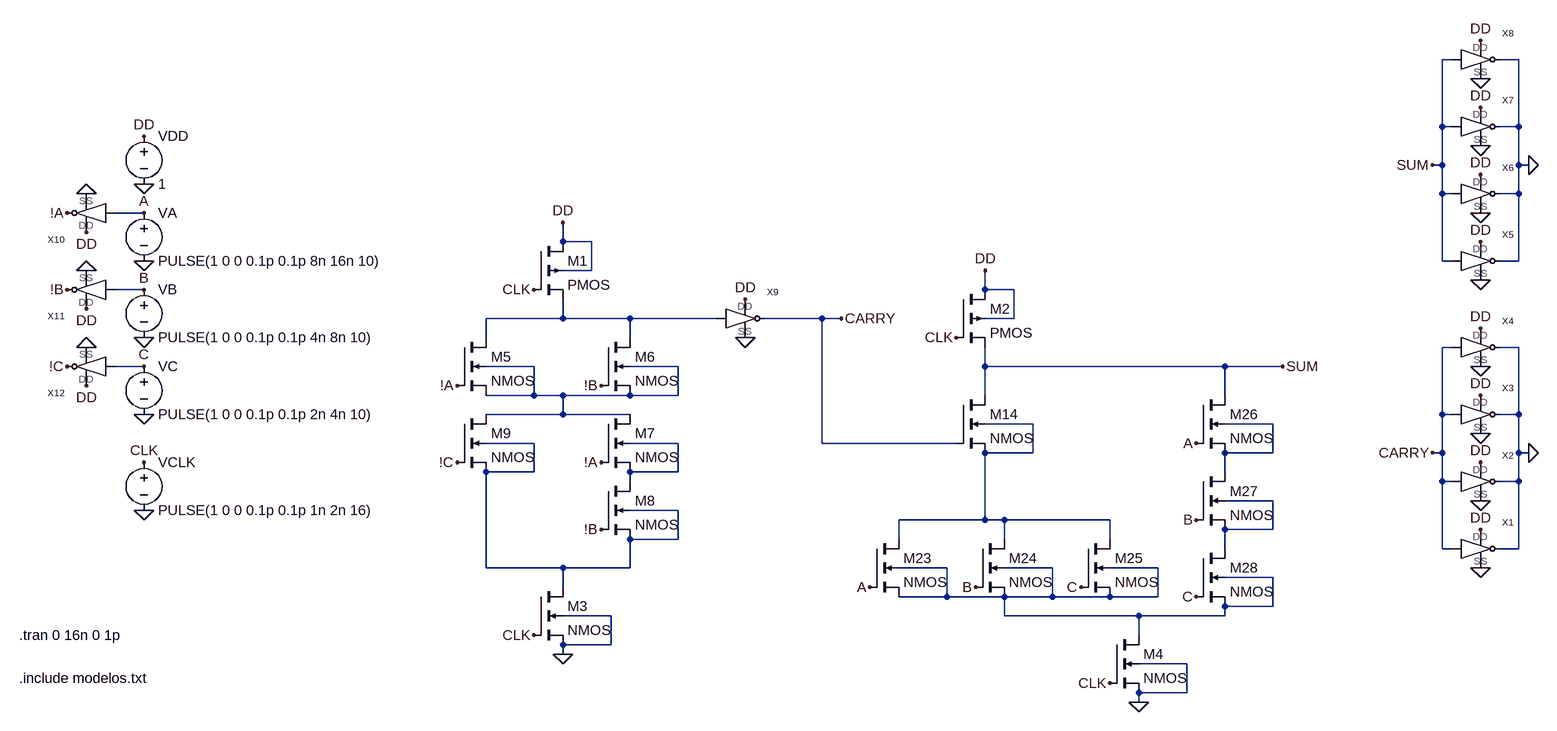
[diagram p0: schematic 2_2.asc]
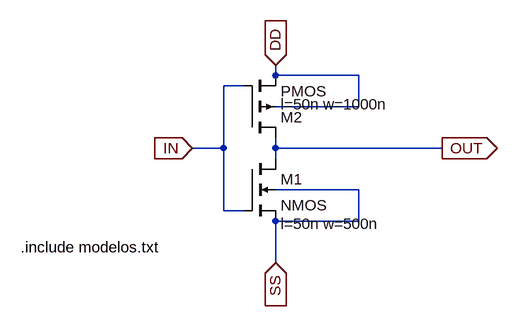
[diagram p1: sub-circuit simb_inv.asc]
2_2.asc, the LTspice schematic file:
Version 4
SHEET 1 3300 1020
WIRE 3152 -80 3136 -80
WIRE 3264 -80 3232 -80
WIRE 3136 32 3136 -80
WIRE 3152 32 3136 32
WIRE 3264 32 3264 -80
WIRE 3264 32 3232 32
WIRE 3136 96 3136 32
WIRE 3136 96 3120 96
WIRE 3264 96 3264 32
WIRE 3280 96 3264 96
WIRE 3136 144 3136 96
WIRE 3152 144 3136 144
WIRE 3264 144 3264 96
WIRE 3264 144 3232 144
WIRE -80 176 -128 176
WIRE 800 224 800 192
WIRE 848 224 800 224
WIRE 3136 256 3136 144
WIRE 3152 256 3136 256
WIRE 3264 256 3264 144
WIRE 3264 256 3232 256
WIRE 848 272 848 224
WIRE 848 272 800 272
WIRE -80 304 -128 304
WIRE 1504 304 1504 272
WIRE 1552 304 1504 304
WIRE 800 352 800 320
WIRE 800 352 672 352
WIRE 912 352 800 352
WIRE 1056 352 912 352
WIRE 1232 352 1136 352
WIRE 1264 352 1232 352
WIRE 1552 352 1552 304
WIRE 1552 352 1504 352
WIRE 672 384 672 352
WIRE 912 384 912 352
WIRE 3152 400 3136 400
WIRE 3264 400 3232 400
WIRE -80 432 -128 432
WIRE 752 432 672 432
WIRE 992 432 912 432
WIRE 1504 432 1504 400
WIRE 1904 432 1504 432
WIRE 2000 432 1904 432
WIRE 752 480 752 432
WIRE 752 480 672 480
WIRE 800 480 752 480
WIRE 912 480 800 480
WIRE 992 480 992 432
WIRE 992 480 912 480
WIRE 1504 480 1504 432
WIRE 1904 480 1904 432
WIRE 800 512 800 480
WIRE 800 512 672 512
WIRE 912 512 800 512
WIRE 3136 512 3136 400
WIRE 3152 512 3136 512
WIRE 3264 512 3264 400
WIRE 3264 512 3232 512
WIRE 1584 528 1504 528
WIRE 1984 528 1904 528
WIRE 752 560 672 560
WIRE 992 560 912 560
WIRE 1232 560 1232 352
WIRE 1456 560 1232 560
WIRE 1584 576 1584 528
WIRE 1584 576 1504 576
WIRE 1984 576 1984 528
WIRE 1984 576 1904 576
WIRE 3136 576 3136 512
WIRE 3136 576 3120 576
WIRE 3264 576 3264 512
WIRE 3280 576 3264 576
WIRE 752 608 752 560
WIRE 752 608 672 608
WIRE 992 608 992 560
WIRE 992 608 912 608
WIRE 1904 608 1904 576
WIRE 912 624 912 608
WIRE 3136 624 3136 576
WIRE 3152 624 3136 624
WIRE 3264 624 3264 576
WIRE 3264 624 3232 624
WIRE 1984 656 1904 656
WIRE 992 672 912 672
WIRE 1504 688 1504 576
WIRE 1504 688 1360 688
WIRE 1536 688 1504 688
WIRE 1712 688 1536 688
WIRE 1984 704 1984 656
WIRE 1984 704 1904 704
WIRE 992 720 992 672
WIRE 992 720 912 720
WIRE 1360 720 1360 688
WIRE 1536 720 1536 688
WIRE 1712 720 1712 688
WIRE 1904 736 1904 704
WIRE 3136 736 3136 624
WIRE 3152 736 3136 736
WIRE 3264 736 3264 624
WIRE 3264 736 3232 736
WIRE 672 768 672 608
WIRE 800 768 672 768
WIRE 912 768 912 720
WIRE 912 768 800 768
WIRE 1440 768 1360 768
WIRE 1616 768 1536 768
WIRE 1792 768 1712 768
WIRE 1984 784 1904 784
WIRE 800 800 800 768
WIRE 1440 816 1440 768
WIRE 1440 816 1360 816
WIRE 1536 816 1440 816
WIRE 1616 816 1616 768
WIRE 1616 816 1536 816
WIRE 1712 816 1616 816
WIRE 1792 816 1792 768
WIRE 1792 816 1712 816
WIRE 1984 832 1984 784
WIRE 1984 832 1904 832
WIRE 880 848 800 848
WIRE 1536 848 1536 816
WIRE 1760 848 1536 848
WIRE 1904 848 1904 832
WIRE 1904 848 1760 848
WIRE 1760 880 1760 848
WIRE 880 896 880 848
WIRE 880 896 800 896
WIRE 800 912 800 896
WIRE 1840 928 1760 928
WIRE 1840 976 1840 928
WIRE 1840 976 1760 976
WIRE 1760 992 1760 976
FLAG -80 512 0
FLAG -80 384 0
FLAG -80 256 0
FLAG -80 128 0
FLAG -80 48 DD
FLAG -80 176 A
FLAG -80 304 B
FLAG -80 432 C
FLAG 1264 352 CARRY
FLAG 1504 272 DD
FLAG 2000 432 SUM
FLAG 1312 800 A
FLAG 1488 800 B
FLAG 1664 800 C
FLAG 1856 560 A
FLAG 1856 688 B
FLAG 1856 816 C
FLAG 3200 288 0
FLAG 3200 176 0
FLAG 3200 64 0
FLAG 3200 -48 0
FLAG 3200 -112 DD
FLAG 3200 0 DD
FLAG 3200 112 DD
FLAG 3200 224 DD
FLAG 3280 96 0
FLAG 3120 96 SUM
FLAG 3200 768 0
FLAG 3200 656 0
FLAG 3200 544 0
FLAG 3200 432 0
FLAG 3200 368 DD
FLAG 3200 480 DD
FLAG 3200 592 DD
FLAG 3200 704 DD
FLAG 3280 576 0
FLAG 3120 576 CARRY
FLAG 1456 384 CLK
FLAG -80 672 0
FLAG -80 592 CLK
FLAG 800 192 DD
FLAG 752 304 CLK
FLAG 752 880 CLK
FLAG 1712 960 CLK
FLAG 1760 992 0
FLAG 800 912 0
FLAG 624 464 !A
FLAG 864 592 !A
FLAG 864 704 !B
FLAG 864 464 !B
FLAG 624 592 !C
FLAG 1104 320 DD
FLAG 1104 384 0
FLAG -208 176 !A
FLAG -208 304 !B
FLAG -208 432 !C
FLAG -176 400 0
FLAG -176 272 0
FLAG -176 144 0
FLAG -176 208 DD
FLAG -176 336 DD
FLAG -176 464 DD
SYMBOL voltage -80 32 R0
SYMATTR InstName VDD
SYMATTR Value 1
SYMBOL voltage -80 160 R0
WINDOW 123 0 0 Left 2
WINDOW 39 0 0 Left 2
SYMATTR InstName VA
SYMATTR Value PULSE(1 0 0 0.1p 0.1p 8n 16n 10)
SYMBOL voltage -80 288 R0
WINDOW 123 0 0 Left 2
WINDOW 39 0 0 Left 2
SYMATTR InstName VB
SYMATTR Value PULSE(1 0 0 0.1p 0.1p 4n 8n 10)
SYMBOL voltage -80 416 R0
WINDOW 123 0 0 Left 2
WINDOW 39 0 0 Left 2
SYMATTR InstName VC
SYMATTR Value PULSE(1 0 0 0.1p 0.1p 2n 4n 10)
SYMBOL nmos4 1456 480 R0
SYMATTR InstName M14
SYMATTR Value2 l=50n w=1000n
SYMBOL nmos4 1312 720 R0
SYMATTR InstName M23
SYMATTR Value2 l=50n w=1000n
SYMBOL nmos4 1488 720 R0
SYMATTR InstName M24
SYMATTR Value2 l=50n w=1000n
SYMBOL nmos4 1664 720 R0
SYMATTR InstName M25
SYMATTR Value2 l=50n w=1000n
SYMBOL nmos4 1856 480 R0
SYMATTR InstName M26
SYMATTR Value2 l=50n w=1500n
SYMBOL nmos4 1856 608 R0
SYMATTR InstName M27
SYMATTR Value2 l=50n w=1500n
SYMBOL nmos4 1856 736 R0
SYMATTR InstName M28
SYMATTR Value2 l=50n w=1500n
SYMBOL pmos4 752 224 R0
SYMATTR InstName M1
SYMATTR Value2 l=50n w=1000n
SYMBOL pmos4 1456 304 R0
SYMATTR InstName M2
SYMATTR Value2 l=50n w=1000n
SYMBOL voltage -80 576 R0
WINDOW 123 0 0 Left 2
WINDOW 39 0 0 Left 2
SYMATTR InstName VCLK
SYMATTR Value PULSE(1 0 0 0.1p 0.1p 1n 2n 16)
SYMBOL nmos4 752 800 R0
SYMATTR InstName M3
SYMATTR Value2 l=50n w=500n
SYMBOL nmos4 1712 880 R0
SYMATTR InstName M4
SYMATTR Value2 l=50n w=500n
SYMBOL simb_inv 3200 736 R0
SYMATTR InstName X1
SYMBOL simb_inv 3200 624 R0
SYMATTR InstName X2
SYMBOL simb_inv 3200 512 R0
SYMATTR InstName X3
SYMBOL simb_inv 3200 400 R0
SYMATTR InstName X4
SYMBOL simb_inv 3200 256 R0
SYMATTR InstName X5
SYMBOL simb_inv 3200 144 R0
SYMATTR InstName X6
SYMBOL simb_inv 3200 32 R0
SYMATTR InstName X7
SYMBOL simb_inv 3200 -80 R0
SYMATTR InstName X8
SYMBOL nmos4 624 384 R0
SYMATTR InstName M5
SYMATTR Value2 l=50n w=1500n
SYMBOL nmos4 864 384 R0
SYMATTR InstName M6
SYMATTR Value2 l=50n w=1500n
SYMBOL nmos4 864 512 R0
SYMATTR InstName M7
SYMATTR Value2 l=50n w=1500n
SYMBOL nmos4 864 624 R0
SYMATTR InstName M8
SYMATTR Value2 l=50n w=1500n
SYMBOL nmos4 624 512 R0
SYMATTR InstName M9
SYMATTR Value2 l=50n w=500n
SYMBOL simb_inv 1104 352 R0
SYMATTR InstName X9
SYMBOL simb_inv -176 176 R180
SYMATTR InstName X10
SYMBOL simb_inv -176 304 R180
SYMATTR InstName X11
SYMBOL simb_inv -176 432 R180
SYMATTR InstName X12
TEXT -288 880 Left 2 !.tran 0 16n 0 1p
TEXT -288 952 Left 2 !.include modelos.txt

simb_inv.asc, the sub-circuit schematic file:
Version 4
SHEET 1 880 680
WIRE 176 32 176 16
WIRE 304 32 176 32
WIRE 128 48 96 48
WIRE 304 80 304 32
WIRE 304 80 176 80
WIRE 96 144 96 48
WIRE 96 144 48 144
WIRE 176 144 176 128
WIRE 432 144 176 144
WIRE 176 160 176 144
WIRE 304 208 176 208
WIRE 96 240 96 144
WIRE 128 240 96 240
WIRE 304 256 304 208
WIRE 304 256 176 256
WIRE 176 320 176 256
FLAG 176 16 DD
IOPIN 176 16 In
FLAG 48 144 IN
IOPIN 48 144 In
FLAG 176 320 SS
IOPIN 176 320 In
FLAG 432 144 OUT
IOPIN 432 144 Out
SYMBOL nmos4 128 160 R0
WINDOW 123 56 100 Left 2
SYMATTR Value2 l=50n w=500n
SYMATTR InstName M1
SYMBOL pmos4 128 128 M180
WINDOW 123 56 52 Left 2
SYMATTR Value2 l=50n w=1000n
SYMATTR InstName M2
TEXT -216 296 Left 2 !.include modelos.txt

The netlist it stands for:
* 2_2.asc
VDD DD 0 1
VA A 0 PULSE(1 0 0 0.1p 0.1p 8n 16n 10)
VB B 0 PULSE(1 0 0 0.1p 0.1p 4n 8n 10)
VC C 0 PULSE(1 0 0 0.1p 0.1p 2n 4n 10)
M14 SUM CARRY N003 N003 NMOS l=50n w=1000n
M23 N003 A N008 N008 NMOS l=50n w=1000n
M24 N003 B N008 N008 NMOS l=50n w=1000n
M25 N003 C N008 N008 NMOS l=50n w=1000n
M26 SUM A N004 N004 NMOS l=50n w=1500n
M27 N004 B N007 N007 NMOS l=50n w=1500n
M28 N007 C N008 N008 NMOS l=50n w=1500n
M1 DD CLK N001 DD PMOS l=50n w=1000n
M2 DD CLK SUM DD PMOS l=50n w=1000n
VCLK CLK 0 PULSE(1 0 0 0.1p 0.1p 1n 2n 16)
M3 N005 CLK 0 0 NMOS l=50n w=500n
M4 N008 CLK 0 0 NMOS l=50n w=500n
XX1 CARRY 0 DD 0 simb_inv
XX2 CARRY 0 DD 0 simb_inv
XX3 CARRY 0 DD 0 simb_inv
XX4 CARRY 0 DD 0 simb_inv
XX5 SUM 0 DD 0 simb_inv
XX6 SUM 0 DD 0 simb_inv
XX7 SUM 0 DD 0 simb_inv
XX8 SUM 0 DD 0 simb_inv
M5 N001 !A N002 N002 NMOS l=50n w=1500n
M6 N001 !B N002 N002 NMOS l=50n w=1500n
M7 N002 !A N006 N006 NMOS l=50n w=1500n
M8 N006 !B N005 N005 NMOS l=50n w=1500n
M9 N002 !C N005 N005 NMOS l=50n w=500n
XX9 N001 CARRY DD 0 simb_inv
XX10 A !A DD 0 simb_inv
XX11 B !B DD 0 simb_inv
XX12 C !C DD 0 simb_inv

* block symbol definitions
.subckt simb_inv IN OUT DD SS
M1 OUT IN SS SS NMOS l=50n w=500n
M2 OUT IN DD DD PMOS l=50n w=1000n
.include modelos.txt
.ends simb_inv

.model NMOS NMOS
.model PMOS PMOS
.lib standard.mos
.tran 0 16n 0 1p
.include modelos.txt
.backanno
.end